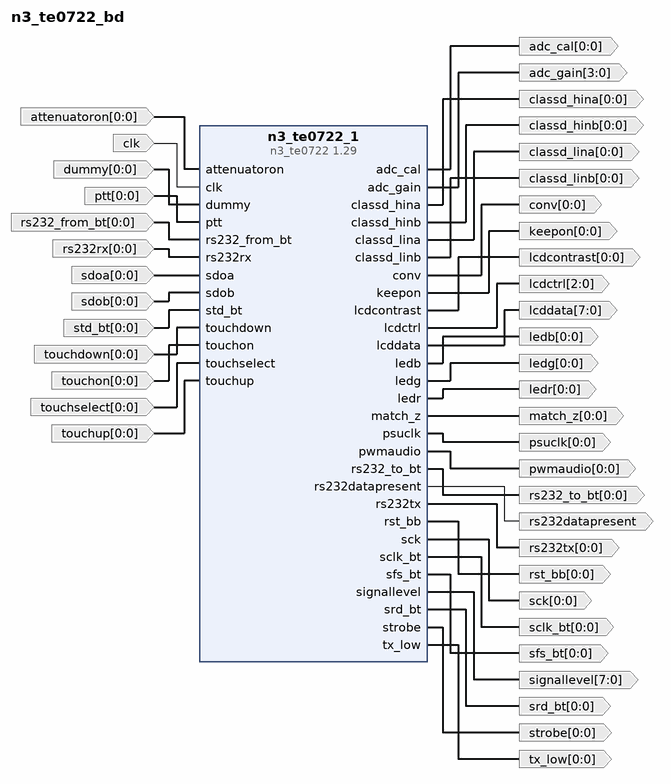
[diagram p0: block diagram of the top level]
# Vivado block design n3_te0722_bd, Vivado 2014.4
create_bd_design n3_te0722_bd

create_bd_port -dir O -from 0 -to 0 -type data adc_cal
create_bd_port -dir O -from 3 -to 0 -type data adc_gain
create_bd_port -dir I -from 0 -to 0 -type data attenuatoron
create_bd_port -dir O -from 0 -to 0 -type data classd_hina
create_bd_port -dir O -from 0 -to 0 -type data classd_hinb
create_bd_port -dir O -from 0 -to 0 -type data classd_lina
create_bd_port -dir O -from 0 -to 0 -type data classd_linb
create_bd_port -dir I -type clk clk
create_bd_port -dir O -from 0 -to 0 -type data conv
create_bd_port -dir I -from 0 -to 0 -type data dummy
create_bd_port -dir O -from 0 -to 0 -type data keepon
create_bd_port -dir O -from 0 -to 0 -type data lcdcontrast
create_bd_port -dir O -from 2 -to 0 -type data lcdctrl
create_bd_port -dir O -from 7 -to 0 -type data lcddata
create_bd_port -dir O -from 0 -to 0 -type data ledb
create_bd_port -dir O -from 0 -to 0 -type data ledg
create_bd_port -dir O -from 0 -to 0 -type data ledr
create_bd_port -dir O -from 0 -to 0 -type data match_z
create_bd_port -dir O -from 0 -to 0 -type data psuclk
create_bd_port -dir I -from 0 -to 0 -type data ptt
create_bd_port -dir O -from 0 -to 0 -type data pwmaudio
create_bd_port -dir I -from 0 -to 0 -type data rs232_from_bt
create_bd_port -dir O -from 0 -to 0 -type data rs232_to_bt
create_bd_port -dir O -type data rs232datapresent
create_bd_port -dir I -from 0 -to 0 -type data rs232rx
create_bd_port -dir O -from 0 -to 0 -type data rs232tx
create_bd_port -dir O -from 0 -to 0 -type data rst_bb
create_bd_port -dir O -from 0 -to 0 -type data sck
create_bd_port -dir O -from 0 -to 0 -type data sclk_bt
create_bd_port -dir I -from 0 -to 0 -type data sdoa
create_bd_port -dir I -from 0 -to 0 -type data sdob
create_bd_port -dir O -from 0 -to 0 -type data sfs_bt
create_bd_port -dir O -from 7 -to 0 -type data signallevel
create_bd_port -dir O -from 0 -to 0 -type data srd_bt
create_bd_port -dir I -from 0 -to 0 -type data std_bt
create_bd_port -dir O -from 0 -to 0 -type data strobe
create_bd_port -dir I -from 0 -to 0 -type data touchdown
create_bd_port -dir I -from 0 -to 0 -type data touchon
create_bd_port -dir I -from 0 -to 0 -type data touchselect
create_bd_port -dir I -from 0 -to 0 -type data touchup
create_bd_port -dir O -from 0 -to 0 -type data tx_low

create_bd_cell -type ip -vlnv AssociationNicola:SysGen:n3_te0722:1.29 n3_te0722_1

# ---- connections ----

connect_bd_net [get_bd_pins n3_te0722_1/adc_cal] [get_bd_ports adc_cal]
connect_bd_net [get_bd_pins n3_te0722_1/adc_gain] [get_bd_ports adc_gain]
connect_bd_net [get_bd_ports attenuatoron] [get_bd_pins n3_te0722_1/attenuatoron]
connect_bd_net [get_bd_pins n3_te0722_1/classd_hina] [get_bd_ports classd_hina]
connect_bd_net [get_bd_pins n3_te0722_1/classd_hinb] [get_bd_ports classd_hinb]
connect_bd_net [get_bd_pins n3_te0722_1/classd_lina] [get_bd_ports classd_lina]
connect_bd_net [get_bd_pins n3_te0722_1/classd_linb] [get_bd_ports classd_linb]
connect_bd_net [get_bd_ports clk] [get_bd_pins n3_te0722_1/clk]
connect_bd_net [get_bd_pins n3_te0722_1/conv] [get_bd_ports conv]
connect_bd_net [get_bd_ports dummy] [get_bd_pins n3_te0722_1/dummy]
connect_bd_net [get_bd_pins n3_te0722_1/keepon] [get_bd_ports keepon]
connect_bd_net [get_bd_pins n3_te0722_1/lcdcontrast] [get_bd_ports lcdcontrast]
connect_bd_net [get_bd_pins n3_te0722_1/lcdctrl] [get_bd_ports lcdctrl]
connect_bd_net [get_bd_pins n3_te0722_1/lcddata] [get_bd_ports lcddata]
connect_bd_net [get_bd_pins n3_te0722_1/ledb] [get_bd_ports ledb]
connect_bd_net [get_bd_pins n3_te0722_1/ledg] [get_bd_ports ledg]
connect_bd_net [get_bd_pins n3_te0722_1/ledr] [get_bd_ports ledr]
connect_bd_net [get_bd_pins n3_te0722_1/match_z] [get_bd_ports match_z]
connect_bd_net [get_bd_pins n3_te0722_1/psuclk] [get_bd_ports psuclk]
connect_bd_net [get_bd_ports ptt] [get_bd_pins n3_te0722_1/ptt]
connect_bd_net [get_bd_pins n3_te0722_1/pwmaudio] [get_bd_ports pwmaudio]
connect_bd_net [get_bd_ports rs232_from_bt] [get_bd_pins n3_te0722_1/rs232_from_bt]
connect_bd_net [get_bd_pins n3_te0722_1/rs232_to_bt] [get_bd_ports rs232_to_bt]
connect_bd_net [get_bd_pins n3_te0722_1/rs232datapresent] [get_bd_ports rs232datapresent]
connect_bd_net [get_bd_ports rs232rx] [get_bd_pins n3_te0722_1/rs232rx]
connect_bd_net [get_bd_pins n3_te0722_1/rs232tx] [get_bd_ports rs232tx]
connect_bd_net [get_bd_pins n3_te0722_1/rst_bb] [get_bd_ports rst_bb]
connect_bd_net [get_bd_pins n3_te0722_1/sck] [get_bd_ports sck]
connect_bd_net [get_bd_pins n3_te0722_1/sclk_bt] [get_bd_ports sclk_bt]
connect_bd_net [get_bd_ports sdoa] [get_bd_pins n3_te0722_1/sdoa]
connect_bd_net [get_bd_ports sdob] [get_bd_pins n3_te0722_1/sdob]
connect_bd_net [get_bd_pins n3_te0722_1/sfs_bt] [get_bd_ports sfs_bt]
connect_bd_net [get_bd_pins n3_te0722_1/signallevel] [get_bd_ports signallevel]
connect_bd_net [get_bd_pins n3_te0722_1/srd_bt] [get_bd_ports srd_bt]
connect_bd_net [get_bd_ports std_bt] [get_bd_pins n3_te0722_1/std_bt]
connect_bd_net [get_bd_pins n3_te0722_1/strobe] [get_bd_ports strobe]
connect_bd_net [get_bd_ports touchdown] [get_bd_pins n3_te0722_1/touchdown]
connect_bd_net [get_bd_ports touchon] [get_bd_pins n3_te0722_1/touchon]
connect_bd_net [get_bd_ports touchselect] [get_bd_pins n3_te0722_1/touchselect]
connect_bd_net [get_bd_ports touchup] [get_bd_pins n3_te0722_1/touchup]
connect_bd_net [get_bd_pins n3_te0722_1/tx_low] [get_bd_ports tx_low]

validate_bd_design
save_bd_design
